# EAGLE board qad-center-v0.8.7 (EAGLE 6.4.4)
REVISION: R1.0; VERSION: V0.8.7
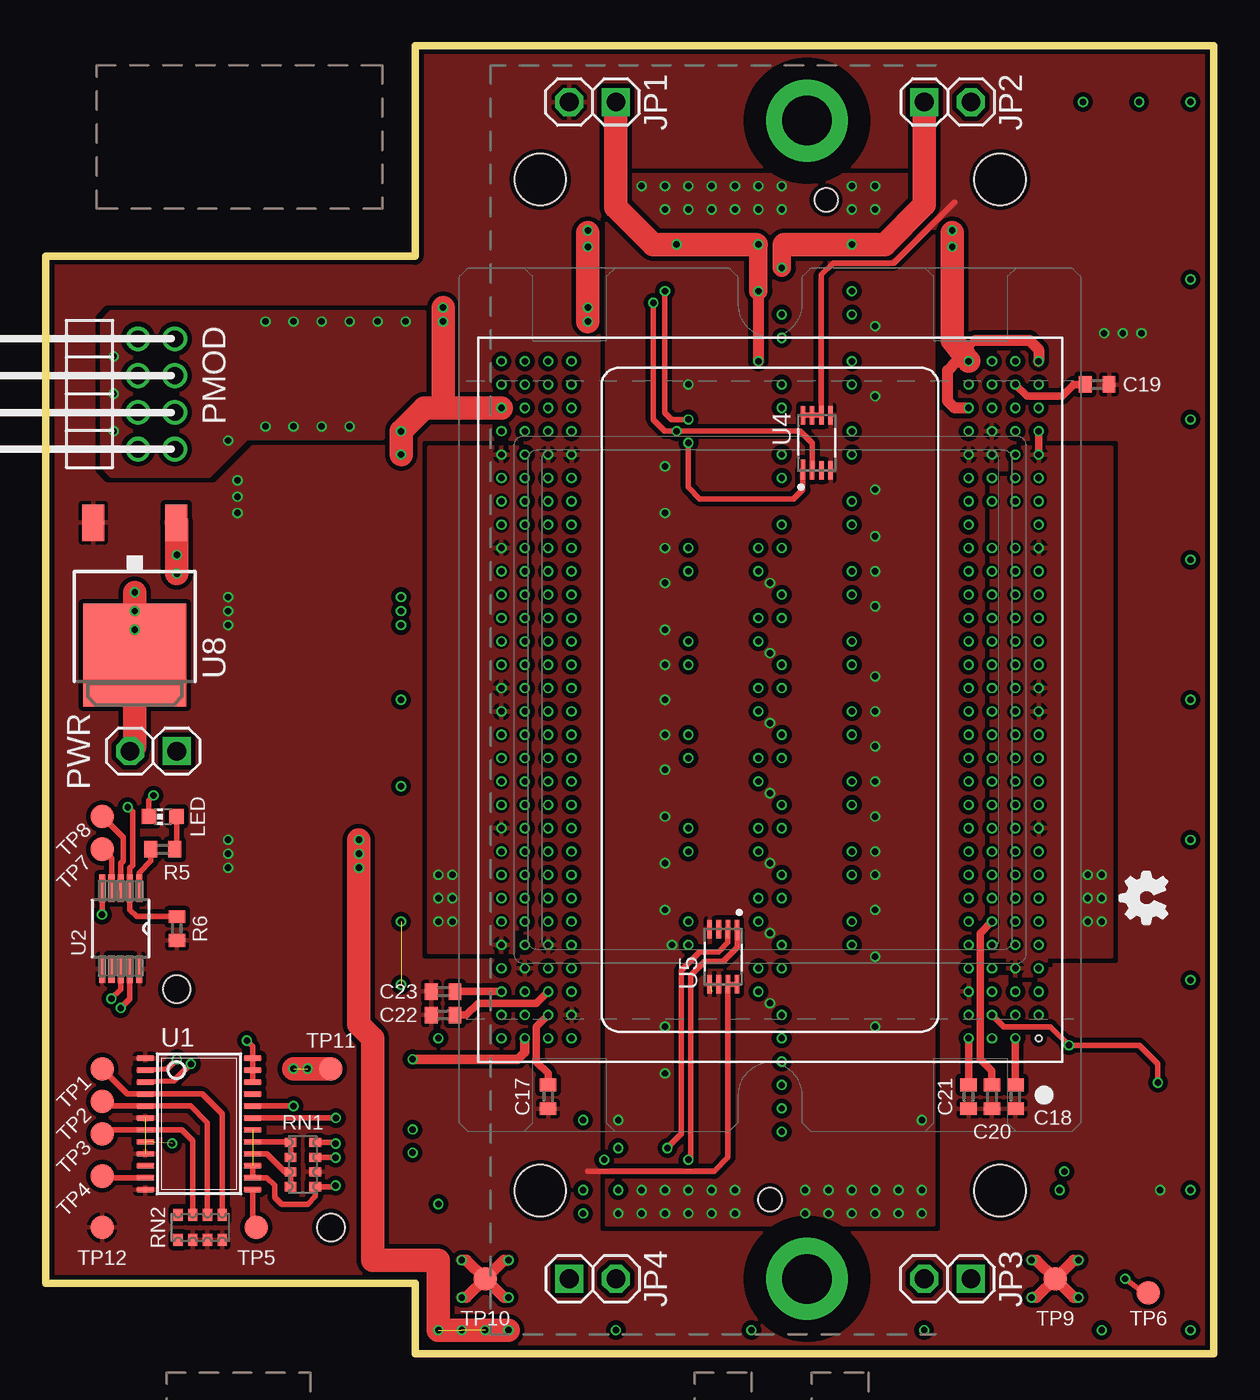
[diagram p3: board, top side]
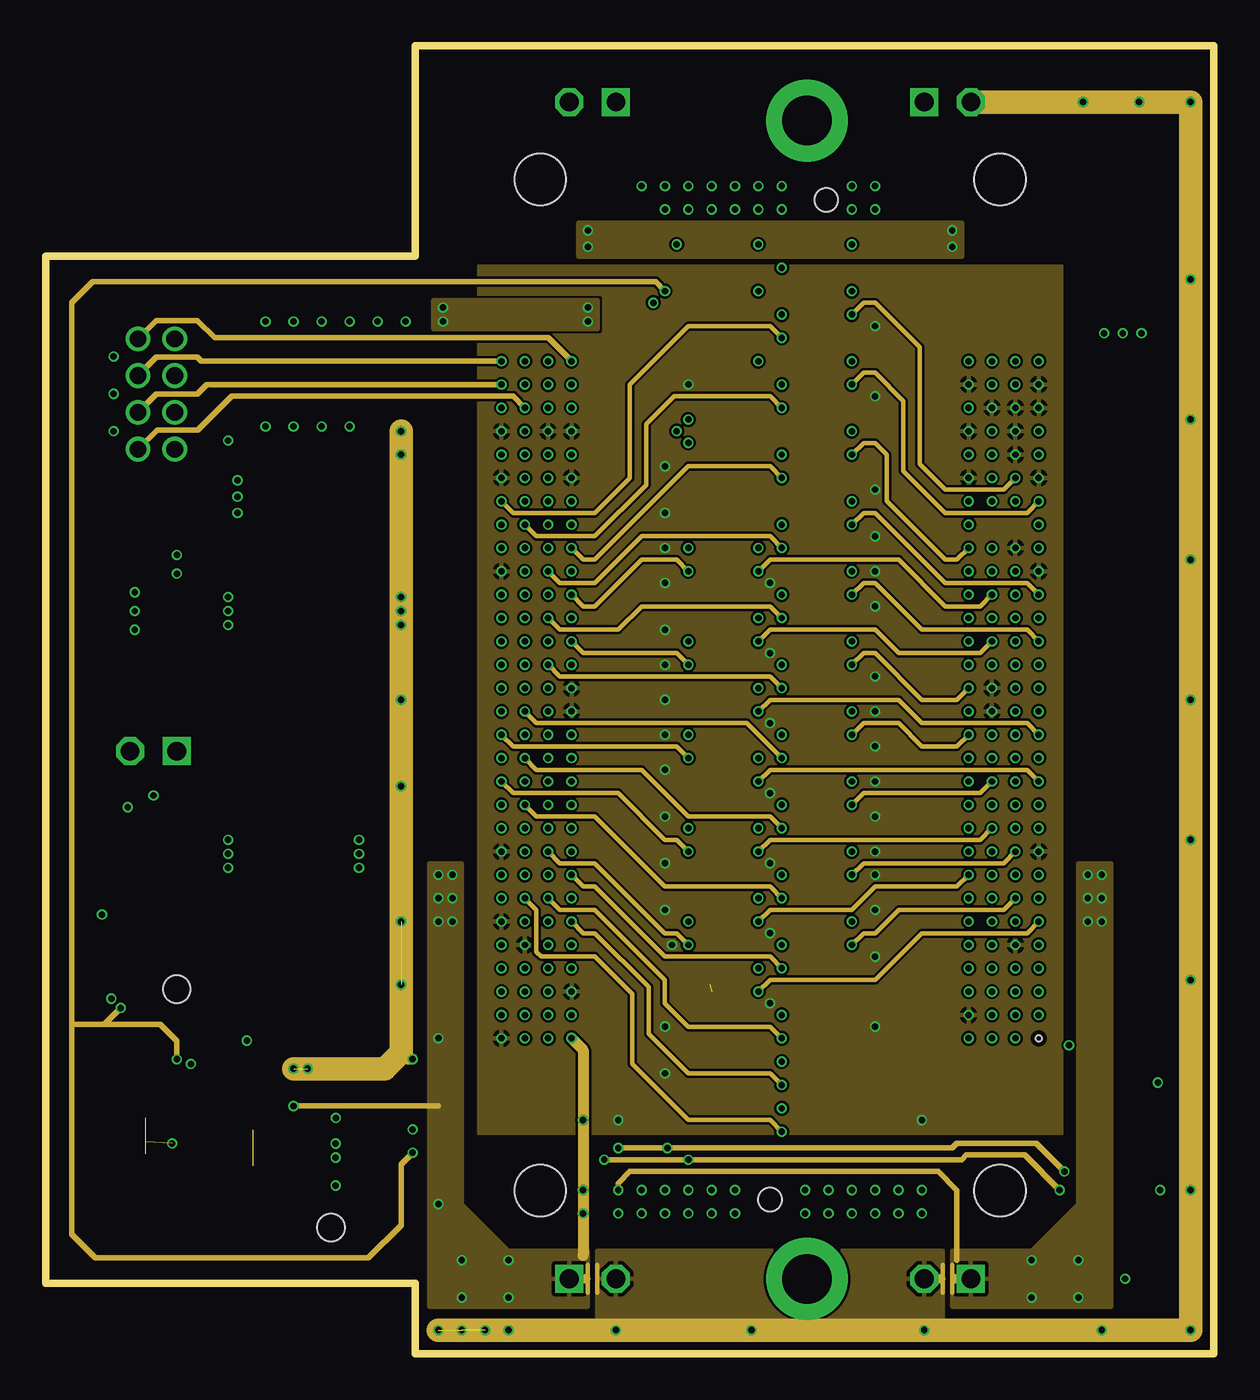
[diagram p4: board, inner layer TopSignal]
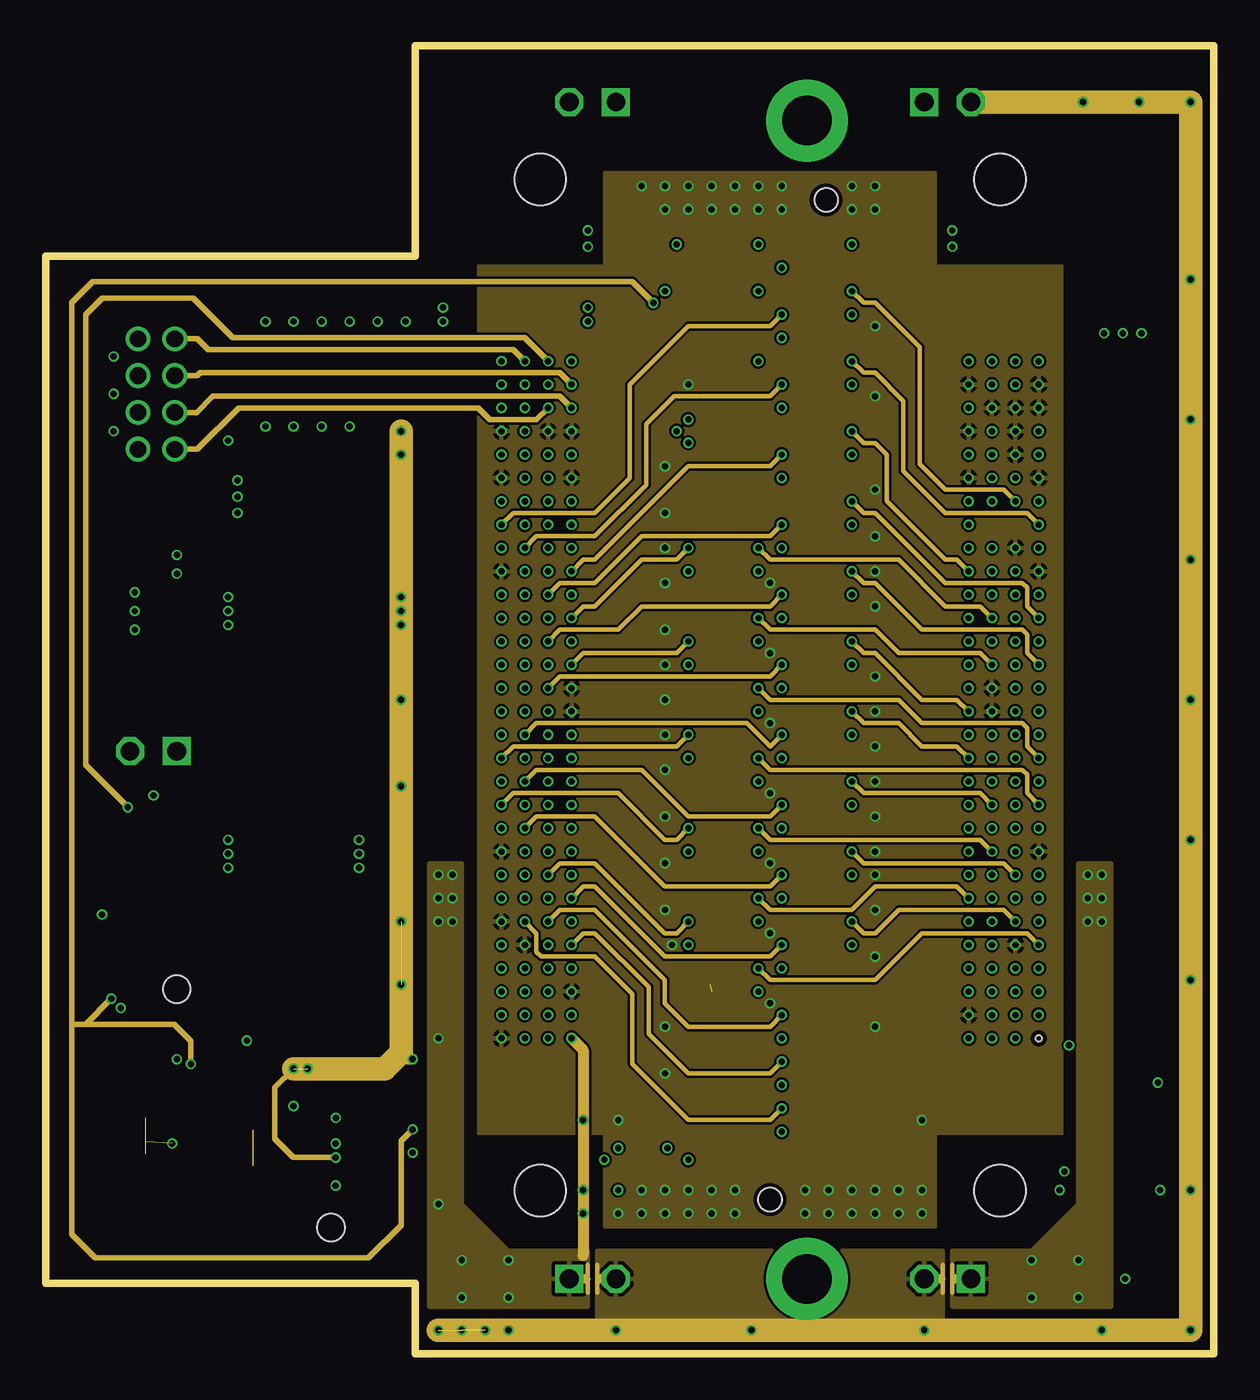
[diagram p5: board, inner layer BottomSignal]
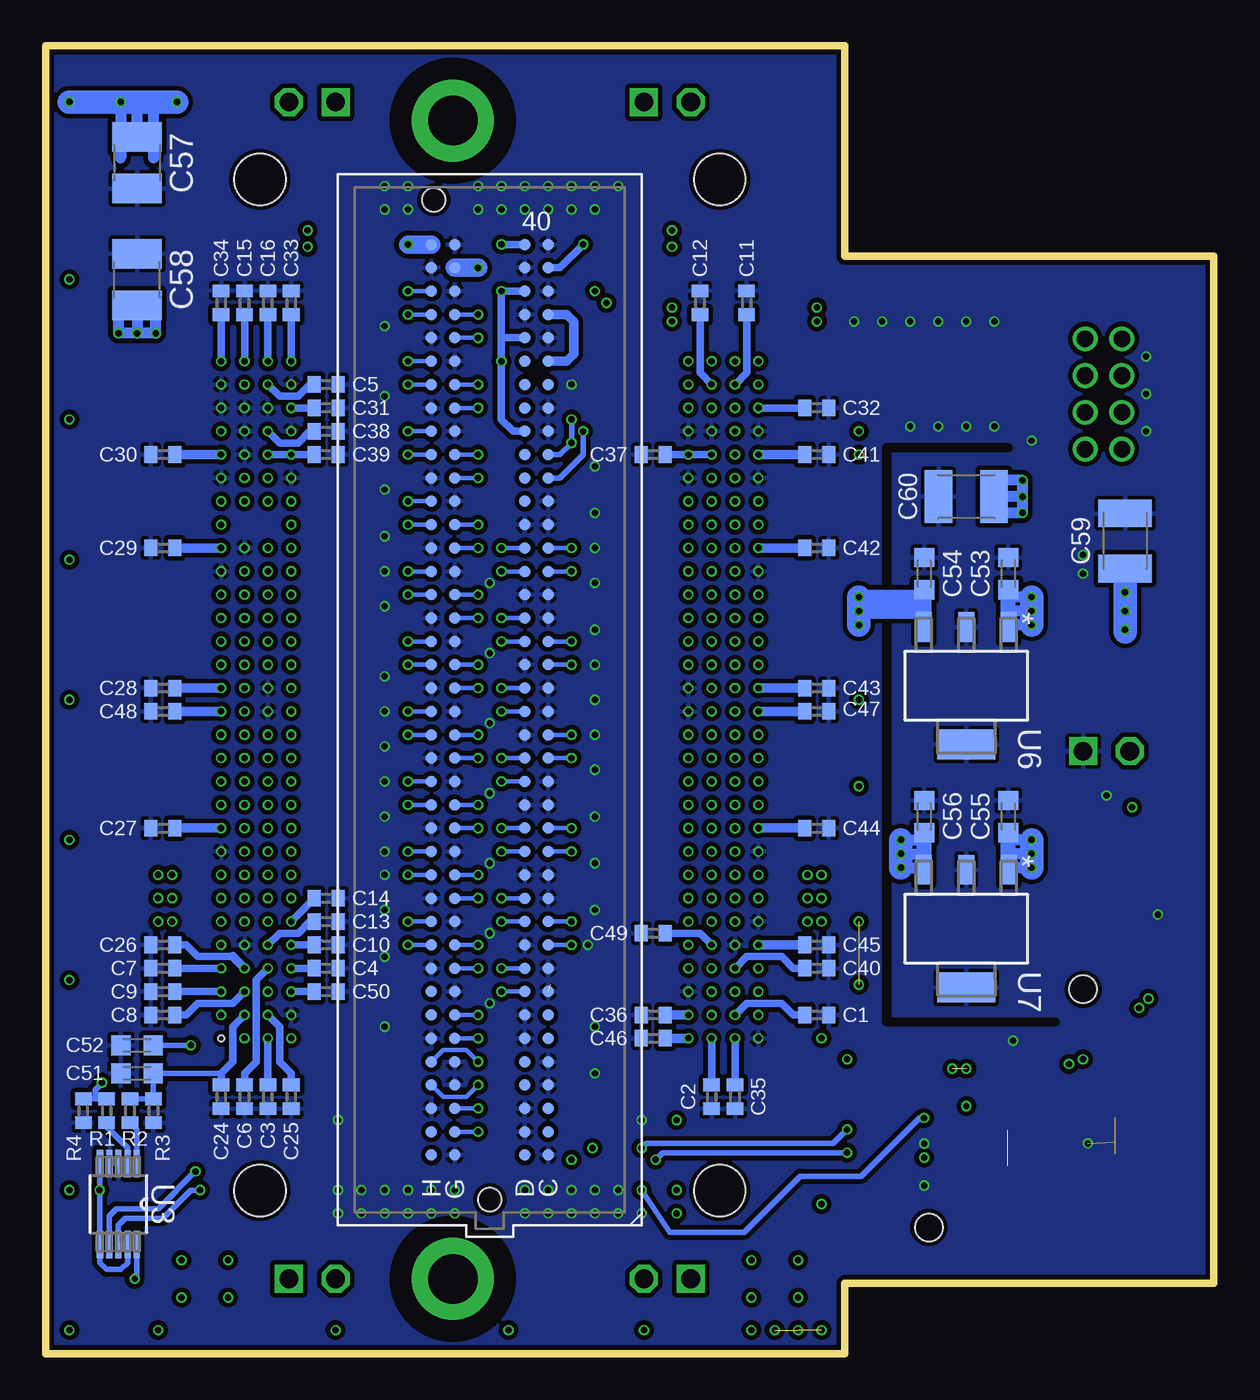
[diagram p6: board, bottom side, seen from below]

Size 63.5 x 71.12 mm. Coordinates in mm from the lower left corner, seen from the top.
Outline: 20.07,0 63.5,0 63.5,71.12 20.07,71.12 20.07,59.68 0,59.68 0,3.81 20.07,3.81 20.07,0
Copper layers (1+2*15+16): Top 0.035559375mm / dielectric 0.17018125mm / TopSignal 0.01778125mm / dielectric 47mil / BottomSignal 0.01778125mm / dielectric 0.2007mm / Bottom 0.035559375mm
Design rules "LaenPCBOrder4L *": minimum track width 5mil, minimum drill 10mil, track to track 5mil, track to pad 5mil, pad to pad 5mil, via to via 5mil, smd to smd 5mil, copper to edge 10mil, drill to drill 5mil, minimum pad ring 4mil, minimum via ring 4mil, stop-mask expansion 4mil, vias tented up to drill 20mil, thermal gap 8mil
Holes 1.5 mm at 15.49,6.86 7.11,19.81
bRestrict: 3 lines

## Footprints (pad centres in the part's own frame; a part is rotated, then mirrored left to right if it is on the bottom)
C0402 = smd 0.7 x 0.9: 1 -0.65,0; 2 0.65,0
C0603K = smd 1.05 x 1.08: 1 -0.875,0; 2 0.875,0
C1210 = smd 1.6 x 2.7: 1 -1.4,0; 2 1.4,0
C1210K = smd 1.5 x 2.9: 1 -1.5,0; 2 1.5,0
1X02-S = drill 1.016 square: 1 -1.27,0 | drill 1.016 octagon: 2 1.27,0
CHIP-LED0603 = smd 0.8 x 0.8: A 0,-0.75; C 0,0.75
2X04/90/2MM = drill 0.9: 1 -3,-4; 2 -1,-4; 3 1,-4; 4 3,-4; 7 -3,-2; 8 -1,-2; 9 1,-2; 10 3,-2
R0402 = smd 0.7 x 0.9: 1 -0.65,0; 2 0.65,0
CAT16 = smd 0.5 x 0.65: 1 -1.2,-0.675; 2 -0.4,-0.675; 3 0.4,-0.675; 4 1.2,-0.675; 5 1.2,0.675; 6 0.4,0.675; 7 -0.4,0.675; 8 -1.2,0.675
B1,27 = smd 1.27 x 1.27: TP 0,0
TSSOP24 = smd 0.305 x 0.991: 1 -3.575,-2.918; 2 -2.925,-2.918; 3 -2.275,-2.918; 4 -1.625,-2.918; 5 -0.975,-2.918; 6 -0.325,-2.918; 7 0.325,-2.918; 8 0.975,-2.918; 9 1.625,-2.918; 10 2.275,-2.918; 11 2.925,-2.918; 12 3.575,-2.918; 13 3.575,2.918; 14 2.925,2.918; 15 2.275,2.918; 16 1.625,2.918; 17 0.975,2.918; 18 0.325,2.918; 19 -0.325,2.918; 20 -0.975,2.918; 21 -1.625,2.918; 22 -2.275,2.918; 23 -2.925,2.918; 24 -3.575,2.918
TSSOP-10 = smd 1.499 x 0.33: 1 -2.2,1; 2 -2.2,0.5; 3 -2.2,0; 4 -2.2,-0.5; 5 -2.2,-1; 6 2.2,-1; 7 2.2,-0.5; 8 2.2,0; 9 2.2,0.5; 10 2.2,1
SOP50P490X110-10N = smd 1.499 x 0.33: 1 -2.2,1; 2 -2.2,0.5; 3 -2.2,0; 4 -2.2,-0.5; 5 -2.2,-1; 6 2.2,-1; 7 2.2,-0.5; 8 2.2,0; 9 2.2,0.5; 10 2.2,1
SOT996-2/3 = smd 0.25 x 1.1: 1 -0.75,-1.45 | smd 0.25 x 1: 2 -0.25,-1.5; 3 0.25,-1.5; 4 0.75,-1.5; 5 0.75,1.5; 6 0.25,1.5; 7 -0.25,1.5; 8 -0.75,1.5
SOT230P700X180-4N = smd 1.626 x 0.889: 1 -3.2,2.311; 2 -3.2,0; 3 -3.2,-2.311 | smd 1.626 x 3.175: 4 3.2,0
TO252 = smd 1.2 x 2: 1 -2.25,-4.8; 2 2.25,-4.8 | smd 5.6 x 5.6: 3 0,2.4
10-30-07-237-400T4+LM = drill 0.35: A2 -17.145,-14.605; A3 -15.875,-14.605; A4 -14.605,-14.605; A5 -13.335,-14.605; A6 -12.065,-14.605; A7 -10.795,-14.605; A8 -9.525,-14.605; A9 -8.255,-14.605; A10 -6.985,-14.605; A11 -5.715,-14.605; A12 -4.445,-14.605; A13 -3.175,-14.605; A14 -1.905,-14.605; A15 -0.635,-14.605; A16 0.635,-14.605; A17 1.905,-14.605; A18 3.175,-14.605; A19 4.445,-14.605; A20 5.715,-14.605; A21 6.985,-14.605; A22 8.255,-14.605; A23 9.525,-14.605; A24 10.795,-14.605; A25 12.065,-14.605; A26 13.335,-14.605; A27 14.605,-14.605; A28 15.875,-14.605; A29 17.145,-14.605; A30 18.415,-14.605; B1 -18.415,-13.335; B2 -17.145,-13.335; B3 -15.875,-13.335; B4 -14.605,-13.335; B5 -13.335,-13.335; B6 -12.065,-13.335; B7 -10.795,-13.335; B8 -9.525,-13.335; B9 -8.255,-13.335; B10 -6.985,-13.335; B11 -5.715,-13.335; B12 -4.445,-13.335; B13 -3.175,-13.335; B14 -1.905,-13.335; B15 -0.635,-13.335; B16 0.635,-13.335; B17 1.905,-13.335; B18 3.175,-13.335; B19 4.445,-13.335; B20 5.715,-13.335; B21 6.985,-13.335; B22 8.255,-13.335; B24 10.795,-13.335; B25 12.065,-13.335; B26 13.335,-13.335; B27 14.605,-13.335; B28 15.875,-13.335; B29 17.145,-13.335; B30 18.415,-13.335; C1 -18.415,-12.065; C2 -17.145,-12.065; C3 -15.875,-12.065; C4 -14.605,-12.065; C5 -13.335,-12.065; C6 -12.065,-12.065; C7 -10.795,-12.065; C8 -9.525,-12.065; C9 -8.255,-12.065; C10 -6.985,-12.065; C11 -5.715,-12.065; C12 -4.445,-12.065; C13 -3.175,-12.065; C14 -1.905,-12.065; C15 -0.635,-12.065; C16 0.635,-12.065; C17 1.905,-12.065; C18 3.175,-12.065; C19 4.445,-12.065; C20 5.715,-12.065; C21 6.985,-12.065; C22 8.255,-12.065; C24 10.795,-12.065; C25 12.065,-12.065; C26 13.335,-12.065; C27 14.605,-12.065; C28 15.875,-12.065; C29 17.145,-12.065; C30 18.415,-12.065; D1 -18.415,-10.795; D2 -17.145,-10.795; D3 -15.875,-10.795; D4 -14.605,-10.795; D5 -13.335,-10.795; D6 -12.065,-10.795; D7 -10.795,-10.795; D8 -9.525,-10.795; D9 -8.255,-10.795; D10 -6.985,-10.795; D11 -5.715,-10.795; D12 -4.445,-10.795; D13 -3.175,-10.795; D14 -1.905,-10.795; D15 -0.635,-10.795; D16 0.635,-10.795; D17 1.905,-10.795; D18 3.175,-10.795; D19 4.445,-10.795; D20 5.715,-10.795; D21 6.985,-10.795; D22 8.255,-10.795; D23 9.525,-10.795; D24 10.795,-10.795; D25 12.065,-10.795; D26 13.335,-10.795; D27 14.605,-10.795; D28 15.875,-10.795; D29 17.145,-10.795; D30 18.415,-10.795; E1 -18.415,10.795; E2 -17.145,10.795; E3 -15.875,10.795; E4 -14.605,10.795; E5 -13.335,10.795; E6 -12.065,10.795; E7 -10.795,10.795; E8 -9.525,10.795; E9 -8.255,10.795; E10 -6.985,10.795; E11 -5.715,10.795; E12 -4.445,10.795; E13 -3.175,10.795; E14 -1.905,10.795; E15 -0.635,10.795; E16 0.635,10.795; E17 1.905,10.795; E18 3.175,10.795; E19 4.445,10.795; E20 5.715,10.795; E21 6.985,10.795; E22 8.255,10.795; E23 9.525,10.795; E24 10.795,10.795; E25 12.065,10.795; E26 13.335,10.795; E27 14.605,10.795; E28 15.875,10.795; E29 17.145,10.795; E30 18.415,10.795; F1 -18.415,12.065; F2 -17.145,12.065; F3 -15.875,12.065; F4 -14.605,12.065; F5 -13.335,12.065; F6 -12.065,12.065; F7 -10.795,12.065; F8 -9.525,12.065; F9 -8.255,12.065; F10 -6.985,12.065; F11 -5.715,12.065; F12 -4.445,12.065; F13 -3.175,12.065; F14 -1.905,12.065; F15 -0.635,12.065; F16 0.635,12.065; F17 1.905,12.065; F18 3.175,12.065; F19 4.445,12.065; F20 5.715,12.065; F21 6.985,12.065; F22 8.255,12.065; F23 9.525,12.065; F24 10.795,12.065; F25 12.065,12.065; F26 13.335,12.065; F27 14.605,12.065; F28 15.875,12.065; F29 17.145,12.065; F30 18.415,12.065; G1 -18.415,13.335; G2 -17.145,13.335; G3 -15.875,13.335; G4 -14.605,13.335; G5 -13.335,13.335; G6 -12.065,13.335; G7 -10.795,13.335; G8 -9.525,13.335; G9 -8.255,13.335; G10 -6.985,13.335; G11 -5.715,13.335; G12 -4.445,13.335; G13 -3.175,13.335; G14 -1.905,13.335; G15 -0.635,13.335; G16 0.635,13.335; G17 1.905,13.335; G18 3.175,13.335; G19 4.445,13.335; G20 5.715,13.335; G21 6.985,13.335; G22 8.255,13.335; G23 9.525,13.335; G24 10.795,13.335; G25 12.065,13.335; G26 13.335,13.335; G27 14.605,13.335; G28 15.875,13.335; G29 17.145,13.335; G30 18.415,13.335; H1 -18.415,14.605; H2 -17.145,14.605; H3 -15.875,14.605; H4 -14.605,14.605; H5 -13.335,14.605; H6 -12.065,14.605; H7 -10.795,14.605; H8 -9.525,14.605; H9 -8.255,14.605; H10 -6.985,14.605; H11 -5.715,14.605; H12 -4.445,14.605; H13 -3.175,14.605; H14 -1.905,14.605; H15 -0.635,14.605; H16 0.635,14.605; H17 1.905,14.605; H18 3.175,14.605; H19 4.445,14.605; H20 5.715,14.605; H21 6.985,14.605; H22 8.255,14.605; H23 9.525,14.605; H24 10.795,14.605; H25 12.065,14.605; H26 13.335,14.605; H27 14.605,14.605; H28 15.875,14.605; H29 17.145,14.605; H30 18.415,14.605 | hole 0.35: -18.415,-14.605 | hole 2.8: 28.3,12.5; 28.3,-12.5; -26.7,-12.5; -26.7,12.5
ASP-134604-01-ZED = smd 0.635 x 0.635 bottom: C1 24.765,-3.175; C2 23.495,-3.175; C3 22.225,-3.175; C4 20.955,-3.175; C5 19.685,-3.175; C6 18.415,-3.175; C7 17.145,-3.175; C8 15.875,-3.175; C9 14.605,-3.175; C10 13.335,-3.175; C11 12.065,-3.175; C12 10.795,-3.175; C13 9.525,-3.175; C14 8.255,-3.175; C15 6.985,-3.175; C16 5.715,-3.175; C17 4.445,-3.175; C18 3.175,-3.175; C19 1.905,-3.175; C20 0.635,-3.175; C21 -0.635,-3.175; C22 -1.905,-3.175; C23 -3.175,-3.175; C24 -4.445,-3.175; C25 -5.715,-3.175; C26 -6.985,-3.175; C27 -8.255,-3.175; C28 -9.525,-3.175; C29 -10.795,-3.175; C30 -12.065,-3.175; C31 -13.335,-3.175; C32 -14.605,-3.175; C33 -15.875,-3.175; C34 -17.145,-3.175; C35 -18.415,-3.175; C36 -19.685,-3.175; C37 -20.955,-3.175; C38 -22.225,-3.175; C39 -23.495,-3.175; C40 -24.765,-3.175; D1 24.765,-1.905; D2 23.495,-1.905; D3 22.225,-1.905; D4 20.955,-1.905; D5 19.685,-1.905; D6 18.415,-1.905; D7 17.145,-1.905; D8 15.875,-1.905; D9 14.605,-1.905; D10 13.335,-1.905; D11 12.065,-1.905; D12 10.795,-1.905; D13 9.525,-1.905; D14 8.255,-1.905; D15 6.985,-1.905; D16 5.715,-1.905; D17 4.445,-1.905; D18 3.175,-1.905; D19 1.905,-1.905; D20 0.635,-1.905; D21 -0.635,-1.905; D22 -1.905,-1.905; D23 -3.175,-1.905; D24 -4.445,-1.905; D25 -5.715,-1.905; D26 -6.985,-1.905; D27 -8.255,-1.905; D28 -9.525,-1.905; D29 -10.795,-1.905; D30 -12.065,-1.905; D31 -13.335,-1.905; D32 -14.605,-1.905; D33 -15.875,-1.905; D34 -17.145,-1.905; D35 -18.415,-1.905; D36 -19.685,-1.905; D37 -20.955,-1.905; D38 -22.225,-1.905; D39 -23.495,-1.905; D40 -24.765,-1.905; G1 24.765,1.905; G2 23.495,1.905; G3 22.225,1.905; G4 20.955,1.905; G5 19.685,1.905; G6 18.415,1.905; G7 17.145,1.905; G8 15.875,1.905; G9 14.605,1.905; G10 13.335,1.905; G11 12.065,1.905; G12 10.795,1.905; G13 9.525,1.905; G14 8.255,1.905; G15 6.985,1.905; G16 5.715,1.905; G17 4.445,1.905; G18 3.175,1.905; G19 1.905,1.905; G20 0.635,1.905; G21 -0.635,1.905; G22 -1.905,1.905; G23 -3.175,1.905; G24 -4.445,1.905; G25 -5.715,1.905; G26 -6.985,1.905; G27 -8.255,1.905; G28 -9.525,1.905; G29 -10.795,1.905; G30 -12.065,1.905; G31 -13.335,1.905; G32 -14.605,1.905; G33 -15.875,1.905; G34 -17.145,1.905; G35 -18.415,1.905; G36 -19.685,1.905; G37 -20.955,1.905; G38 -22.225,1.905; G39 -23.495,1.905; G40 -24.765,1.905; H1 24.765,3.175; H2 23.495,3.175; H3 22.225,3.175; H4 20.955,3.175; H5 19.685,3.175; H6 18.415,3.175; H7 17.145,3.175; H8 15.875,3.175; H9 14.605,3.175; H10 13.335,3.175; H11 12.065,3.175; H12 10.795,3.175; H13 9.525,3.175; H14 8.255,3.175; H15 6.985,3.175; H16 5.715,3.175; H17 4.445,3.175; H18 3.175,3.175; H19 1.905,3.175; H20 0.635,3.175; H21 -0.635,3.175; H22 -1.905,3.175; H23 -3.175,3.175; H24 -4.445,3.175; H25 -5.715,3.175; H26 -6.985,3.175; H27 -8.255,3.175; H28 -9.525,3.175; H29 -10.795,3.175; H30 -12.065,3.175; H31 -13.335,3.175; H32 -14.605,3.175; H33 -15.875,3.175; H34 -17.145,3.175; H35 -18.415,3.175; H36 -19.685,3.175; H37 -20.955,3.175; H38 -22.225,3.175; H39 -23.495,3.175; H40 -24.765,3.175 | drill 2.692 pad 4.445: M1 -31.496,2.007; M2 31.496,2.007 | hole 1.27: 27.191,0; -27.191,3.048

## Placement (x,y rotation side)
C1  100n  [C0402]  21.59,18.42 0 bottom
C2  100n  [C0402]  27.3,13.97 270 bottom
C3  100n  [C0402]  51.43,13.97 270 bottom
C4  100n  [C0402]  48.26,20.96 0 bottom
C5  100n  [C0402]  48.26,52.7 0 bottom
C6  100n  [C0402]  52.7,13.97 270 bottom
C7  100n  [C0402]  57.15,20.96 180 bottom
C8  100n  [C0402]  57.15,18.42 180 bottom
C9  100n  [C0402]  57.15,19.69 180 bottom
C10  100n  [C0402]  48.26,22.23 0 bottom
C11  100n  [C0402]  25.4,57.15 90 bottom
C12  100n  [C0402]  27.94,57.15 90 bottom
C13  100n  [C0402]  48.26,23.5 0 bottom
C14  100n  [C0402]  48.26,24.77 0 bottom
C15  100n  [C0402]  52.7,57.15 90 bottom
C16  100n  [C0402]  51.43,57.15 90 bottom
C17  100n  [C0402]  27.3,13.97 90 top
C18  100n  [C0402]  52.7,13.97 90 top
C19  100n  [C0402]  57.15,52.7 180 top
C20  100n  [C0402]  51.43,13.97 90 top
C21  100n  [C0402]  50.16,13.97 90 top
C22  100n  [C0402]  21.59,18.42 0 top
C23  100n  [C0402]  21.59,19.69 0 top
C24  100n  [C0402]  53.97,13.97 270 bottom
C25  100n  [C0402]  50.16,13.97 270 bottom
C26  100n  [C0402]  57.15,22.23 180 bottom
C27  100n  [C0402]  57.15,28.58 180 bottom
C28  100n  [C0402]  57.15,36.2 180 bottom
C29  100n  [C0402]  57.15,43.82 180 bottom
C30  100n  [C0402]  57.15,48.9 180 bottom
C31  100n  [C0402]  48.26,51.44 0 bottom
C32  100n  [C0402]  21.59,51.44 0 bottom
C33  100n  [C0402]  50.16,57.15 90 bottom
C34  100n  [C0402]  53.97,57.15 90 bottom
C35  100n  [C0402]  26.03,13.97 270 bottom
C36  100n  [C0402]  30.48,18.42 180 bottom
C37  100n  [C0402]  30.48,48.9 180 bottom
C38  100n  [C0402]  48.26,50.17 0 bottom
C39  100n  [C0402]  48.26,48.9 0 bottom
C40  100n  [C0402]  21.59,20.96 0 bottom
C41  100n  [C0402]  21.59,48.9 0 bottom
C42  100n  [C0402]  21.59,43.82 0 bottom
C43  100n  [C0402]  21.59,36.2 0 bottom
C44  100n  [C0402]  21.59,28.58 0 bottom
C45  100n  [C0402]  21.59,22.23 0 bottom
C46  100n  [C0402]  30.48,17.15 180 bottom
C47  100n  [C0402]  21.59,34.93 0 bottom
C48  100n  [C0402]  57.15,34.93 180 bottom
C49  100n  [C0402]  30.48,22.86 180 bottom
C50  100n  [C0402]  48.26,19.69 0 bottom
C51  10u  [C0603K]  58.55,15.24 180 bottom
C52  10u  [C0603K]  58.55,16.76 180 bottom
C53  10u  [C0603K]  11.18,42.42 90 bottom
C54  10u  [C0603K]  15.75,42.42 90 bottom
C55  10u  [C0603K]  11.18,29.21 90 bottom
C56  10u  [C0603K]  15.75,29.21 90 bottom
C57  100u  [C1210]  58.55,64.77 270 bottom
C58  100u  [C1210]  58.55,58.42 90 bottom
C59  100u  [C1210K]  4.83,44.2 90 bottom
C60  100u  [C1210K]  13.46,46.61 180 bottom
JP1  [1X02-S]  29.72,68.07 180 top
JP2  [1X02-S]  49.02,68.07 0 top
JP3  [1X02-S]  49.02,4.06 180 top
JP4  [1X02-S]  29.72,4.06 0 top
LED  RED  [CHIP-LED0603]  6.35,29.21 90 top
PMOD  PMOD-8  [2X04/90/2MM]  3,52.19 90 top
PWR  [1X02-S]  5.84,32.77 180 top
R1  1R  [R0402]  60.2,13.21 270 bottom
R2  1R  [R0402]  58.93,13.21 270 bottom
R3  [R0402]  57.66,13.21 270 bottom
R4  [R0402]  61.47,13.21 270 bottom
R5  220R  [R0402]  6.35,27.43 0 top
R6  10k  [R0402]  7.11,23.11 90 top
RN1  10k  [CAT16]  13.97,10.28 90 top
RN2  10k  [CAT16]  8.38,6.86 0 top
TP1  TPB1,27  [B1,27]  3.05,15.49 0 top
TP2  TPB1,27  [B1,27]  3.05,13.72 0 top
TP3  TPB1,27  [B1,27]  3.05,11.94 0 top
TP4  TPB1,27  [B1,27]  3.05,9.65 0 top
TP5  TPB1,27  [B1,27]  11.43,6.86 0 top
TP6  TPB1,27  [B1,27]  59.94,3.3 0 top
TP7  TPB1,27  [B1,27]  3.05,27.43 0 top
TP8  TPB1,27  [B1,27]  3.05,29.21 0 top
TP9  TPB1,27  [B1,27]  54.86,4.06 0 top
TP10  TPB1,27  [B1,27]  23.88,4.06 0 top
TP11  TPB1,27  [B1,27]  15.49,15.49 0 top
TP12  TPB1,27  [B1,27]  3.05,6.86 0 top
U1  LM96080  [TSSOP24]  8.32,12.49 270 top
U2  PCA9537  [TSSOP-10]  4.06,23.11 270 top
U3  AD5647R  [SOP50P490X110-10N]  59.56,8.13 270 bottom
U4  LM75BGD  [SOT996-2/3]  41.91,49.53 0 top
U5  LM75BGD  [SOT996-2/3]  36.83,21.59 180 top
U6  MCP1826S-3002E/DB  [SOT230P700X180-4N]  13.46,36.32 270 bottom
U7  MCP1826S-1802E/DB  [SOT230P700X180-4N]  13.46,23.11 270 bottom
U8  AP1084TO252  [TO252]  4.83,40.39 180 top
U$1  CMV12000ANDON+LM  [10-30-07-237-400T4+LM]  39.37,35.56 90 top
U$5  [OSHW_FILLX100_NOTEXT]  60.96,23.37 90 top
ZED1  FMC-LPC-ZED_NOCCZED  [ASP-134604-01-ZED]  39.37,35.56 270 top

## Tracks (layer width: path | path; a pad name or v marks a point on that pad's centre or on a via)
+1V8  (via drill 0.35, 0.35 pad 0.41)  (2 unrouted)
  Top 1.27: v25.15,1.27 v21.34,1.27 21.34,5.08 17.78,5.08 17.78,17.15 17.02,17.91 v17.02,26.42 v17.02,27.18 v17.02,27.94
  TopSignal 0.254: 29.97,3.3 29.97,4.83 | 48.77,3.3 48.77,4.83
  TopSignal 0.508: JP3.2 48.64,4.06
  TopSignal 1.27: v21.34,1.27 v30.99,1.27 v38.35,1.27 v47.75,1.27 v57.4,1.27 v62.23,1.27 v62.23,8.89 v62.23,20.32 v62.23,27.94 v62.23,35.56 v62.23,43.18 v62.23,50.8 v62.23,58.42 v62.23,68.07 v56.39,68.07 JP2.2
  BottomSignal 0.254: 29.97,3.3 29.97,4.83 | 48.77,3.3 48.77,4.83
  BottomSignal 0.508: 30.1,4.06 JP4.2 | JP3.2 48.64,4.06
  BottomSignal 1.27: JP2.2 v56.39,68.07 v62.23,68.07 v62.23,58.42 v62.23,50.8 v62.23,43.18 v62.23,35.56 v62.23,27.94 v62.23,20.32 v62.23,8.89 v62.23,1.27 v57.4,1.27 v47.75,1.27 v38.35,1.27 v30.99,1.27 v21.34,1.27
  Bottom 0.61: 15.77,26.42 U7.3 | v17.02,27.18 15.75,27.18 | v17.02,26.42 15.75,26.42 | v17.02,27.94 15.75,27.94 | C57.1 58.55,68.07 | 57.66,68.07 57.66,65.02 | v59.44,68.07 59.44,65.02
  Bottom 0.813: U7.3 15.75,26.31 15.75,26.42 15.75,27.18 15.75,27.94 C56.1
  Bottom 1.27: v17.02,27.94 v17.02,27.18 v17.02,26.42 | v56.39,68.07 57.66,68.07 58.55,68.07 v59.44,68.07 v62.23,68.07
  other vias: 22.61,1.27 23.88,1.27
  pour BottomSignal: 29.97,5.59 48.77,5.59 48.77,1.02 29.97,1.02
  pour TopSignal: 29.97,5.59 48.77,5.59 48.77,1.02 29.97,1.02
+1V8A  (via drill 0.35, 0.35 pad 0.41)
  Top 0.305: U1.19 v15.76,12.82
  Top 0.406: U$1.A26 U$1.A27
  Top 0.61: TP9.TP 55.88,3.05 v56.13,3.05 | TP9.TP 53.85,3.05 v53.59,3.05 | TP9.TP 55.88,5.08 v56.13,5.08 | TP9.TP 53.85,5.08 v53.59,5.08
  TopSignal 0.254: 49.28,3.3 49.28,4.83
  TopSignal 0.305: 49.53,5.08 49.53,8.89 48.51,9.91 31.75,9.91 31.11,9.27 v31.11,8.89
  TopSignal 0.508: 49.4,4.06 JP3.1
  BottomSignal 0.254: 49.28,3.3 49.28,4.83
  BottomSignal 0.508: 49.4,4.06 JP3.1
  Bottom 0.305: v31.11,8.89 29.59,6.6 25.53,6.6 22.48,9.65 19.18,9.65 16,12.83 15.77,12.83 v15.76,12.82
  Bottom 0.406: C26.1 55.88,22.23 55.24,21.59 53.34,21.59
  Bottom 0.508: C27.1 U$1.A10 | 53.34,21.59 U$1.B4 | C28.1 U$1.A16 | C29.1 U$1.A22 | C30.1 U$1.A26 | U$1.A15 C48.1
  other vias: 56.64,26.04 57.4,26.04 56.64,24.77 57.4,24.77 56.64,23.5 57.4,23.5
  pour BottomSignal: 49.28,5.59 53.59,5.59 56.13,8.13 56.13,26.67 57.91,26.67 57.91,2.54 49.28,2.54
  pour Top (isolate 0.152, rank 3): 57.91,49.28 52.7,49.28 52.7,47.62 51.43,47.62 51.43,21.59 52.32,21.59 52.32,20.57 54.36,20.57 54.36,21.59 57.91,21.59
  pour TopSignal: 49.28,5.59 53.59,5.59 56.13,8.13 56.13,26.67 57.91,26.67 57.91,2.54 49.28,2.54
+1V8B  (via drill 0.35)
  Top 0.305: U1.20 v13.46,13.46
  Top 0.61: TP10.TP 24.89,5.08 v25.15,5.08 | TP10.TP 22.86,5.08 v22.61,5.08 | TP10.TP 22.86,3.05 v22.61,3.05 | TP10.TP 24.89,3.05 v25.15,3.05
  TopSignal 0.254: 29.46,4.83 29.46,3.3
  TopSignal 0.305: v13.46,13.46 21.34,13.46
  TopSignal 0.508: 29.34,4.06 JP4.1
  TopSignal 0.61: U$1.E1 29.21,16.51 v29.21,12.7 v29.21,8.89 v29.21,7.62 29.21,5.33
  BottomSignal 0.254: 29.46,4.83 29.46,3.3
  BottomSignal 0.508: 29.34,4.06 JP4.1
  BottomSignal 0.61: 29.21,5.33 v29.21,7.62 v29.21,8.89 v29.21,12.7 29.21,16.51 U$1.E1
  Bottom 0.508: C42.1 U$1.H22 | C43.1 U$1.H16 | C41.1 U$1.H26 | C44.1 U$1.H10 | C45.1 U$1.H5 | U$1.H15 C47.1 | C46.1 U$1.E1
  other vias: 21.34,26.04 22.1,26.04 21.34,24.77 22.1,24.77 21.34,23.5 22.1,23.5 21.34,8.13 21.34,17.15
  pour TopSignal: 20.83,26.67 22.61,26.67 22.61,8.13 25.15,5.59 29.46,5.59 29.46,2.54 20.83,2.54
  pour Top (isolate 0.152, rank 3): 26.03,23.11 26.03,49.28 20.83,49.28 20.83,21.84 25.4,21.84 25.4,23.11
  pour BottomSignal: 20.83,26.67 22.61,26.67 22.61,8.13 25.15,5.59 29.46,5.59 29.46,2.54 20.83,2.54
+3V0  (via drill 0.35, 0.35 pad 0.41)  (2 unrouted)
  Top 0.305: RN1.3 14.66,10.66 v15.75,10.66
  Top 0.406: 50.16,54.74 50.55,55.12
  Top 0.508: U$1.G1 26.03,16.38 25.65,16 v19.94,16
  Top 0.61: U$1.D28 49.4,51.44 49.02,51.82 49.02,53.47 49.53,53.98 U$1.D30 50.16,54.74 | 50.55,55.12 53.47,55.12 53.97,54.61 U$1.A30
  Top 1.27: U$1.D30 49.28,55.12 v49.28,60.2 49.28,60.96 | v19.3,48.9 v19.3,50.17 20.57,51.44 21.59,51.44 | v29.46,56.13 v29.46,56.9 v29.46,60.2 29.46,60.96 | U$1.H28 21.59,51.44 | v21.59,56.9 v21.59,56.13 21.59,51.44 | v13.46,15.49 TP11.TP
  TopSignal 0.508: 19.3,16.26 19.3,16.38
  TopSignal 0.61: v19.94,16 19.68,16 19.3,16.38
  TopSignal 1.27: v19.3,50.17 v19.3,48.9 v19.3,39.62 v19.3,35.56 v19.3,30.86 v19.3,20.07 19.3,16.38 18.41,15.49 v13.46,15.49
  BottomSignal 0.305: v15.75,10.66 13.45,10.66 12.45,11.68 12.45,14.48 v13.46,15.49
  BottomSignal 0.61: v19.94,16 19.68,16 19.3,16.38
  BottomSignal 1.27: v19.3,50.17 v19.3,48.9 v19.3,39.62 v19.3,35.56 v19.3,30.86 v19.3,20.07 19.3,16.38 18.41,15.49 v13.46,15.49
  Bottom 0.406: C32.1 U$1.H28 | C31.1 U$1.D28 | C33.1 U$1.D30 | C34.1 U$1.A30 | U$1.G1 C35.1
  Bottom 0.813: v19.3,40.39 15.77,40.39 U6.3 15.75,39.52 15.75,41.15 | 15.75,41.15 C54.1 | 19.3,40.89 v19.3,41.15 15.75,41.15
  Bottom 1.27: v19.3,40.39 19.3,40.89 | v19.3,41.15 v19.3,40.39 | v19.3,40.39 v19.3,39.62
  other vias: 29.46,61.09 49.28,61.09 14.22,15.49 19.3,23.5
  pour TopSignal: 28.96,61.47 49.78,61.47 49.78,59.69 28.96,59.69
  pour TopSignal: 21.08,57.28 21.08,55.75 29.97,55.75 29.97,57.28
+3V3  (via drill 0.35, 0.35 pad 0.41)  (1 unrouted)
  Top 0.305: 49.42,62.61 49.42,62.63 46.1,59.31 42.79,59.31 42.16,58.67 U4.6 U4.7 U4.8 | U5.8 U5.7 37.08,10.66 36.32,9.91 29.46,9.91
  Bottom 0.305: U3.9 59.06,4.95 59.44,4.57 60.2,4.57 60.56,4.94 U3.6 60.56,8.87 v60.58,8.89 60.56,8.91 U3.5
  Bottom 0.406: U$1.G4 25.4,21.59 23.49,21.59 22.86,20.96 C40.1 | C38.1 49.15,50.17 49.78,49.53 50.8,49.53 U$1.C27 | C39.1 U$1.C26 | C37.1 U$1.F26 | C49.1 27.94,22.86 U$1.F5 | C50.1 U$1.D3
  Bottom 0.508: C36.1 U$1.E2
  Bottom 0.61: v9.91,27.94 11.18,27.94 | v9.91,26.42 11.18,26.42 | v9.91,27.18 11.18,27.18 | v9.91,39.62 11.15,39.62 U6.1 | v9.91,40.39 11.18,40.39 | v9.91,41.15 11.18,41.15 | 11.96,45.72 v10.41,45.72 v10.41,47.5 11.94,47.5 | v10.41,46.61 11.94,46.61 | C58.1 v58.55,55.5 | v57.53,55.5 57.53,57.15 59.56,57.15 v59.56,55.5 v57.53,55.5
  Bottom 0.813: U6.1 11.18,39.52 11.18,40.39 11.18,41.15 C53.1 | C55.1 11.18,27.94 11.18,27.18 11.18,26.42 11.18,26.31 U7.1 11.15,27.18 | 11.96,45.72 C60.1 | 11.94,47.5 11.94,46.61
  Bottom 1.27: v9.91,26.42 v9.91,27.18 v9.91,27.94 | v9.91,41.15 v9.91,40.39 v9.91,39.62
  pour Top (isolate 0.254, rank 4): 20.07,71.12 63.5,71.12 63.5,0 20.07,0 20.07,3.81 0,3.81 0,59.69 20.07,59.69
+5V  (via drill 0.35 pad 0.41)
  Top 1.27: v4.83,41.4 U8.3 4.83,33.02 PWR.2
  Bottom 1.27: C59.1 v4.83,41.4 v4.83,40.39 v4.83,39.37 4.83,39.26
GND  (via drill 0.35, 0.35 pad 0.41)  (3 unrouted)
  Top 0.305: v15.75,9.14 15.68,9.08 RN1.1 14.64,8.54 14.22,8.12 12.83,8.12 12.45,8.51 12.45,9.14 12.02,9.57 U1.14 U1.15 | RN1.4 15.68,11.48 v15.75,11.42 | U1.22 U1.23 U1.24 11.24,16.7 v10.92,17.02 | U2.5 3.05,25.3 v3.05,23.88 | v5.84,30.35 5.6,30.09 LED.C
  Top 1.27: U8.1 7.11,45.19 v7.11,43.43 v7.11,42.42
  other vias: 31.11,12.7 47.62,7.62 46.35,7.62 45.08,7.62 47.62,8.89 39.37,41.91 39.37,38.1 39.37,34.29 39.37,30.48 39.37,26.67 39.37,22.86 39.37,19.05 45.08,21.59 45.08,17.78 45.08,29.21 45.08,33.02 45.08,36.83 45.08,40.64 45.08,44.45 45.08,52.07 45.08,55.88 33.66,35.56 46.35,8.89 33.66,39.37 33.66,41.91 47.62,12.7 45.08,8.89 43.81,8.89 42.54,8.89 43.81,7.62 42.54,7.62 41.27,8.89 41.27,7.62 32.38,8.89 33.66,8.89 34.92,8.89 34.92,7.62 36.2,7.62 36.2,8.89 37.46,7.62 37.46,8.89 31.11,7.62 32.38,7.62 33.66,7.62 45.08,31.12 45.08,27.3 33.66,33.66 34.04,22.23 34.92,63.5 36.2,63.5 37.46,63.5 38.73,63.5 40,62.23 45.08,63.5 43.81,63.5 33.66,62.23 32.38,63.5 33.66,63.5 40,63.5 34.92,62.23 36.2,62.23 37.46,62.23 38.73,62.23 45.08,62.23 43.81,62.23 6.86,11.43 33.66,29.21 45.08,24.13 45.08,42.55 33.66,45.72 33.66,48.26 45.08,46.99 33.66,37.47 33.66,31.75 33.66,26.67 33.66,24.13 33.66,17.78 33.66,15.24 45.08,26.04 45.08,34.93 34.92,52.7 33.66,43.82 11.94,50.42 14.99,50.42 18.03,56.13 16.51,50.42 13.46,50.42 9.91,49.66 11.94,56.13 13.46,56.13 14.99,56.13 16.51,56.13 19.56,56.13 3.68,54.23 3.68,52.2 3.68,50.17
  pour Bottom (isolate 0.254): 20.07,71.12 63.5,71.12 63.5,0 20.07,0 20.07,3.81 0,3.81 0,59.69 20.07,59.69
  pour Top (isolate 0.254, rank 3): 30.48,64.14 48.26,64.14 48.26,6.99 30.48,6.99
  pour TopSignal (rank 2): 23.49,11.94 55.24,11.94 55.24,59.18 23.49,59.18
  pour BottomSignal: 48.39,6.86 48.39,11.94 55.24,11.94 55.24,59.18 48.39,59.18 48.39,64.26 30.35,64.26 30.35,59.18 23.49,59.18 23.49,11.94 30.35,11.94 30.35,6.86
  pour Top (isolate 0.254): 3.05,48.26 3.05,56.13 3.56,56.64 20.57,56.64 20.57,52.07 18.29,49.78 10.92,49.78 8.89,47.75 3.56,47.75
N$1
  Top 0.406: U$1.F2 26.67,17.78 26.67,15.88 27.3,15.24 C17.2
N$2
  Top 0.406: C18.2 U$1.B1
N$3
  Top 0.406: U$1.B29 53.34,52.07 55.24,52.07 55.88,52.7 C19.2
N$4
  Top 0.406: U$1.C6 50.8,22.86 50.8,16 51.43,15.37 C20.2
N$5
  Top 0.406: U$1.D1 C21.2
N$6
  Top 0.406: C22.2 22.86,18.42 23.49,19.05 26.67,19.05 U$1.F3
N$7
  Top 0.406: C23.2 U$1.H3
N$8
  Bottom 0.406: U$1.G2 25.4,19.05 23.49,19.05 22.86,18.42 C1.1
N$9
  Bottom 0.406: C2.1 U$1.F1
N$10
  Bottom 0.406: C3.1 U$1.C1
N$11
  Bottom 0.406: C4.1 U$1.D4
N$12
  Bottom 0.406: C5.1 49.15,52.7 49.78,52.07 50.8,52.07 U$1.C29
N$13
  Bottom 0.406: U$1.C4 52.07,20.32 52.07,15.88 52.7,15.24 C6.1
N$14
  Bottom 0.406: C7.1 U$1.A4
N$15
  Bottom 0.406: U$1.B3 53.34,19.05 55.24,19.05 55.88,18.42 C8.1
N$16
  Bottom 0.406: C9.1 U$1.A3
N$17
  Bottom 0.406: C10.1 U$1.D5
N$18
  Bottom 0.406: C11.1 25.4,53.34 U$1.G29
N$19
  Bottom 0.406: C12.1 27.94,53.34 U$1.F29
N$20
  Bottom 0.305: 49.15,23.5 C13.1
  Bottom 0.406: U$1.C5 50.8,22.86 49.78,22.86 49.15,23.5
N$21
  Bottom 0.406: C14.1 U$1.D6
N$22
  Bottom 0.406: C15.1 U$1.B30
N$23
  Bottom 0.406: C16.1 U$1.C30
N$24  (via drill 0.35)
  BottomSignal 0.254: U$1.B6 52.07,24.13 46.35,24.13 45.08,22.86 44.45,22.86 v43.81,23.5
  Bottom 0.254: v43.81,23.5 ZED1.H11
N$25  (via drill 0.35)
  TopSignal 0.254: U$1.B7 52.07,24.13 46.35,24.13 45.08,22.86 44.45,22.86 v43.81,22.23
  Bottom 0.254: v43.81,22.23 ZED1.H10
N$26
  BottomSignal 0.305: U$1.F28 26.67,50.8 24.13,50.8 23.49,51.44 10.48,51.44 8.23,49.19 PMOD.1
N$27  (via drill 0.35)
  BottomSignal 0.254: U$1.D7 49.53,25.4 45.08,25.4 43.81,24.13 39.37,24.13 v38.73,24.77
  Bottom 0.254: v38.73,24.77 ZED1.D12
N$28  (via drill 0.35)
  TopSignal 0.254: U$1.D8 49.53,25.4 45.08,25.4 43.81,24.13 39.37,24.13 v38.73,23.5
  Bottom 0.254: v38.73,23.5 ZED1.D11
N$29
  TopSignal 0.305: U$1.H29 8.75,52.7 8.24,52.19 6,52.19 PMOD.8
N$30
  BottomSignal 0.305: U$1.E28 27.94,52.07 9.08,52.07 8.2,51.19 PMOD.2
N$31
  TopSignal 0.305: U$1.G28 25.4,52.07 10.1,52.07 8.25,50.23 6.04,50.23 PMOD.7
N$32
  TopSignal 0.305: U$1.E30 27.3,55.25 9.18,55.25 8.24,56.19 6,56.19 PMOD.10
N$33
  BottomSignal 0.305: U$1.G30 25.4,54.61 8.82,54.61 8.24,55.19 PMOD.4
N$34  (via drill 0.35)
  BottomSignal 0.254: U$1.B8 52.07,26.67 44.45,26.67 v43.81,27.3
  Bottom 0.254: v43.81,27.3 ZED1.H14
N$35  (via drill 0.35)
  BottomSignal 0.254: U$1.C9 50.8,27.94 39.37,27.94 v38.73,28.58
  Bottom 0.254: v38.73,28.58 ZED1.D15
N$36  (via drill 0.35)
  TopSignal 0.254: U$1.C10 50.8,27.94 39.37,27.94 v38.73,27.3
  Bottom 0.254: v38.73,27.3 ZED1.D14
N$37
  Bottom 0.508: ZED1.C35 35.18,53.98 34.8,54.36 34.8,56.13 35.18,56.52 ZED1.C37
N$38  (via drill 0.35)
  Top 0.61: v38.73,57.79 v38.73,53.98
  Top 1.016: v38.73,57.79 v38.73,60.33 38.61,60.33
  Top 1.27: 38.61,60.33 v34.29,60.33 33.02,60.33 30.99,62.36 JP1.1
  Bottom 0.406: ZED1.D32 38.1,50.17 38.73,50.8 v38.73,53.98 | v38.73,53.98 38.73,55.25 | 38.73,55.25 v38.73,57.79 | ZED1.C39 35.56,59.06 v34.29,60.33 | ZED1.D36 38.73,55.25 | v38.73,57.79 ZED1.D38 | v38.73,60.33 ZED1.D40 | v38.73,53.98 v38.73,57.79
N$39  (via drill 0.35)
  Top 1.016: v40,59.06 40,60.33 40.13,60.33
  Top 1.27: 40.13,60.33 v43.81,60.33 45.59,60.33 47.75,62.48 JP2.1
  Bottom 1.016: ZED1.G39 v40,59.06 | v43.81,60.33 ZED1.H40
N$42
  Bottom 0.305: U3.2 59.06,11.18 60.2,12.32 R1.2
N$43  (via drill 0.35)
  BottomSignal 0.254: U$1.G10 26.67,29.21 29.84,29.21 33.66,25.4 39.37,25.4 v40,26.04
  Bottom 0.254: v40,26.04 ZED1.G13
N$44  (via drill 0.35)
  BottomSignal 0.254: v38.73,32.39 39.37,31.75 53.09,31.75 53.34,31.5 53.34,30.48 U$1.A11
  Bottom 0.254: v38.73,32.39 ZED1.D18
N$45  (via drill 0.35)
  TopSignal 0.254: U$1.A12 53.34,31.75 39.37,31.75 v38.73,31.12
  Bottom 0.254: v38.73,31.12 ZED1.D17
N$46  (via drill 0.35)
  BottomSignal 0.254: U$1.C11 50.8,30.48 44.45,30.48 v43.81,31.12
  Bottom 0.254: v43.81,31.12 ZED1.H17
N$47  (via drill 0.35)
  TopSignal 0.254: U$1.C12 50.8,30.48 44.45,30.48 v43.81,29.85
  Bottom 0.254: v43.81,29.85 ZED1.H16
N$48  (via drill 0.35)
  BottomSignal 0.254: v38.73,36.2 39.37,35.56 46.35,35.56 47.62,34.29 53.09,34.29 53.34,34.04 53.34,33.02 U$1.A13
  Bottom 0.254: v38.73,36.2 ZED1.D21
N$49  (via drill 0.35)
  TopSignal 0.254: U$1.A14 53.34,34.29 47.62,34.29 46.35,35.56 39.37,35.56 v38.73,34.93
  Bottom 0.254: v38.73,34.93 ZED1.D20
N$50  (via drill 0.35)
  BottomSignal 0.254: U$1.D13 49.53,33.02 47.62,33.02 46.35,34.29 44.45,34.29 v43.81,34.93
  Bottom 0.254: v43.81,34.93 ZED1.H20
N$51  (via drill 0.35)
  TopSignal 0.254: U$1.D14 49.53,33.02 47.62,33.02 46.35,34.29 44.45,34.29 v43.81,33.66
  Bottom 0.254: v43.81,33.66 ZED1.H19
N$52  (via drill 0.35)
  BottomSignal 0.254: U$1.F16 27.94,36.83 39.37,36.83 v40,37.47
  Bottom 0.254: v40,37.47 ZED1.G22
N$53  (via drill 0.35)
  TopSignal 0.254: U$1.F17 27.94,36.83 39.37,36.83 v40,36.2
  Bottom 0.254: v40,36.2 ZED1.G21
N$54  (via drill 0.35)
  BottomSignal 0.254: v43.81,42.55 44.45,41.91 45.08,41.91 47.62,39.37 53.09,39.37 53.34,39.12 53.34,38.1 U$1.A17
  Bottom 0.254: v43.81,42.55 ZED1.H26
N$55  (via drill 0.35)
  TopSignal 0.254: U$1.A18 53.34,39.37 47.62,39.37 45.08,41.91 44.45,41.91 v43.81,41.28
  Bottom 0.254: v43.81,41.28 ZED1.H25
N$56  (via drill 0.35)
  BottomSignal 0.254: U$1.C17 50.8,38.1 46.35,38.1 45.08,39.37 39.37,39.37 v38.73,40.01
  Bottom 0.254: v38.73,40.01 ZED1.D24
N$57  (via drill 0.35)
  TopSignal 0.254: U$1.C18 50.8,38.1 46.35,38.1 45.08,39.37 39.37,39.37 v38.73,38.73
  Bottom 0.254: v38.73,38.73 ZED1.D23
N$58  (via drill 0.35)
  BottomSignal 0.254: v43.81,46.36 44.45,45.72 45.08,45.72 48.89,41.91 53.09,41.91 53.34,41.66 53.34,40.64 U$1.A19
  Bottom 0.254: v43.81,46.36 ZED1.H29
N$59  (via drill 0.35)
  TopSignal 0.254: U$1.A20 53.34,41.91 48.89,41.91 45.08,45.72 44.45,45.72 v43.81,45.09
  Bottom 0.254: v43.81,45.09 ZED1.H28
N$60  (via drill 0.35)
  BottomSignal 0.254: U$1.C19 50.8,40.64 48.89,40.64 46.35,43.18 39.37,43.18 v38.73,43.82
  Bottom 0.254: v38.73,43.82 ZED1.D27
N$61  (via drill 0.35)
  TopSignal 0.254: U$1.C20 50.8,40.64 48.89,40.64 46.35,43.18 39.37,43.18 v38.73,42.55
  Bottom 0.254: v38.73,42.55 ZED1.D26
N$62  (via drill 0.35)
  BottomSignal 0.254: U$1.D21 49.53,43.18 48.89,43.18 45.72,46.36 45.72,48.9 45.08,49.53 44.45,49.53 v43.81,50.17
  Bottom 0.254: v43.81,50.17 ZED1.H32
N$63  (via drill 0.35)
  TopSignal 0.254: U$1.D22 49.53,43.18 48.89,43.18 45.72,46.36 45.72,48.9 45.08,49.53 44.45,49.53 v43.81,48.9
  Bottom 0.254: v43.81,48.9 ZED1.H31
N$64  (via drill 0.35)
  BottomSignal 0.254: U$1.A23 53.34,45.72 48.89,45.72 46.61,48.01 46.61,51.82 45.08,53.34 44.45,53.34 v43.81,53.98
  Bottom 0.254: v43.81,53.98 ZED1.H35
N$65  (via drill 0.35)
  TopSignal 0.254: U$1.A24 53.34,45.72 48.89,45.72 46.61,48.01 46.61,51.82 45.08,53.34 44.45,53.34 v43.81,52.7
  Bottom 0.254: v43.81,52.7 ZED1.H34
N$66  (via drill 0.35)
  BottomSignal 0.254: U$1.B24 52.07,46.99 48.89,46.99 47.5,48.39 47.5,54.74 45.08,57.15 44.45,57.15 v43.81,57.79
  Bottom 0.254: v43.81,57.79 ZED1.H38
N$67  (via drill 0.35)
  TopSignal 0.254: U$1.B25 52.07,46.99 48.89,46.99 47.5,48.39 47.5,54.74 45.08,57.15 44.45,57.15 v43.81,56.52
  Bottom 0.254: v43.81,56.52 ZED1.H37
N$68  (via drill 0.35)
  BottomSignal 0.254: U$1.D15 49.53,35.56 47.62,35.56 45.08,38.1 44.45,38.1 v43.81,38.73
  Bottom 0.254: v43.81,38.73 ZED1.H23
N$69  (via drill 0.35)
  TopSignal 0.254: U$1.D16 49.53,35.56 47.62,35.56 45.08,38.1 44.45,38.1 v43.81,37.47
  Bottom 0.254: v43.81,37.47 ZED1.H22
N$70  (via drill 0.35)
  BottomSignal 0.254: U$1.G22 26.67,44.45 29.84,44.45 32.64,47.24 32.64,50.55 34.16,52.07 39.37,52.07 v40,52.7
  Bottom 0.254: v40,52.7 ZED1.G34
N$71  (via drill 0.35)
  TopSignal 0.254: U$1.G23 26.67,44.45 29.84,44.45 32.64,47.24 32.64,50.55 34.16,52.07 39.37,52.07 v40,51.44
  Bottom 0.254: v40,51.44 ZED1.G33
N$72  (via drill 0.35)
  TopSignal 0.254: U$1.E22 29.21,43.18 29.84,43.18 34.92,48.26 39.37,48.26 v40,47.62
  Bottom 0.254: v40,47.62 ZED1.G30
N$73  (via drill 0.35)
  BottomSignal 0.254: U$1.E21 29.21,43.18 29.84,43.18 34.92,48.26 39.37,48.26 v40,48.9
  Bottom 0.254: v40,48.9 ZED1.G31
N$74  (via drill 0.35)
  TopSignal 0.254: U$1.F21 27.94,41.91 29.84,41.91 32.38,44.45 39.37,44.45 v40,43.82
  Bottom 0.254: v40,43.82 ZED1.G27
N$75  (via drill 0.35)
  BottomSignal 0.254: U$1.F20 27.94,41.91 29.84,41.91 32.38,44.45 39.37,44.45 v40,45.09
  Bottom 0.254: v40,45.09 ZED1.G28
N$76  (via drill 0.35)
  TopSignal 0.254: U$1.E20 29.21,40.64 29.84,40.64 32.38,43.18 34.29,43.18 v34.92,42.55
  Bottom 0.254: v34.92,42.55 ZED1.C26
N$77  (via drill 0.35)
  BottomSignal 0.254: U$1.E19 29.21,40.64 29.84,40.64 32.38,43.18 34.29,43.18 v34.92,43.82
  Bottom 0.254: v34.92,43.82 ZED1.C27
N$78  (via drill 0.35)
  TopSignal 0.254: U$1.F19 27.94,39.37 31.11,39.37 32.38,40.64 39.37,40.64 v40,40.01
  Bottom 0.254: v40,40.01 ZED1.G24
N$79  (via drill 0.35)
  BottomSignal 0.254: U$1.F18 27.94,39.37 31.11,39.37 32.38,40.64 39.37,40.64 v40,41.28
  Bottom 0.254: v40,41.28 ZED1.G25
N$80  (via drill 0.35)
  TopSignal 0.254: U$1.E18 29.21,38.1 34.29,38.1 v34.92,37.47
  Bottom 0.254: v34.92,37.47 ZED1.C22
N$81  (via drill 0.35)
  BottomSignal 0.254: U$1.E17 29.21,38.1 34.29,38.1 v34.92,38.73
  Bottom 0.254: v34.92,38.73 ZED1.C23
N$82  (via drill 0.35)
  BottomSignal 0.254: U$1.H23 25.4,45.72 29.84,45.72 31.75,47.62 31.75,52.7 34.92,55.88 39.37,55.88 v40,56.52
  Bottom 0.254: v40,56.52 ZED1.G37
N$83  (via drill 0.35)
  TopSignal 0.254: U$1.H24 25.4,45.72 29.84,45.72 31.75,47.62 31.75,52.7 34.92,55.88 39.37,55.88 v40,55.25
  Bottom 0.254: v40,55.25 ZED1.G36
N$84  (via drill 0.35)
  TopSignal 0.254: U$1.G15 26.67,34.29 38.1,34.29 v40,32.39
  Bottom 0.254: v40,32.39 ZED1.G18
N$85  (via drill 0.35)
  BottomSignal 0.254: U$1.G14 26.67,34.29 38.1,34.29 39.37,33.02 v40,33.66
  Bottom 0.254: v40,33.66 ZED1.G19
N$86  (via drill 0.35)
  TopSignal 0.254: U$1.H14 25.4,33.02 34.29,33.02 v34.92,32.39
  Bottom 0.254: v34.92,32.39 ZED1.C18
N$87  (via drill 0.35)
  BottomSignal 0.254: U$1.H13 25.4,33.02 34.29,33.02 v34.92,33.66
  Bottom 0.254: v34.92,33.66 ZED1.C19
N$88  (via drill 0.35)
  TopSignal 0.254: U$1.G13 26.67,31.75 32.38,31.75 34.92,29.21 39.37,29.21 v40,28.58
  Bottom 0.254: v40,28.58 ZED1.G15
N$89  (via drill 0.35)
  BottomSignal 0.254: U$1.G12 26.67,31.75 32.38,31.75 34.92,29.21 39.37,29.21 v40,29.85
  Bottom 0.254: ZED1.G16 v40,29.85
N$90  (via drill 0.35)
  TopSignal 0.254: U$1.H12 25.4,30.48 31.11,30.48 33.66,27.94 34.29,27.94 v34.92,27.3
  Bottom 0.254: v34.92,27.3 ZED1.C14
N$91  (via drill 0.35)
  BottomSignal 0.254: U$1.H11 25.4,30.48 31.11,30.48 33.66,27.94 34.29,27.94 v34.92,28.58
  Bottom 0.254: v34.92,28.58 ZED1.C15
N$92  (via drill 0.35)
  TopSignal 0.254: U$1.G11 26.67,29.21 29.84,29.21 33.66,25.4 39.37,25.4 v40,24.77
  Bottom 0.254: v40,24.77 ZED1.G12
N$93  (via drill 0.35)
  TopSignal 0.254: U$1.B9 52.07,26.67 44.45,26.67 v43.81,26.04
  Bottom 0.254: v43.81,26.04 ZED1.H13
N$94  (via drill 0.35)
  TopSignal 0.254: U$1.F9 27.94,26.67 29.84,26.67 33.66,22.86 34.29,22.86 v34.92,22.23
  Bottom 0.254: v34.92,22.23 ZED1.C10
N$95  (via drill 0.35)
  BottomSignal 0.254: U$1.F8 27.94,26.67 29.84,26.67 33.66,22.86 34.29,22.86 v34.92,23.5
  Bottom 0.254: ZED1.C11 v34.92,23.5
N$96  (via drill 0.35)
  TopSignal 0.254: U$1.E8 29.21,25.4 29.84,25.4 33.66,21.59 39.37,21.59 v40,20.96
  Bottom 0.254: v40,20.96 ZED1.G9
N$97  (via drill 0.35)
  BottomSignal 0.254: U$1.E7 29.21,25.4 29.84,25.4 33.66,21.59 39.37,21.59 v40,22.23
  Bottom 0.254: v40,22.23 ZED1.G10
N$98  (via drill 0.35)
  TopSignal 0.254: U$1.F7 27.94,24.13 29.84,24.13 33.66,20.32 33.66,19.05 34.92,17.78 39.37,17.78 v40,17.15
  Bottom 0.254: v40,17.15 ZED1.G6
N$99  (via drill 0.35)
  BottomSignal 0.254: U$1.F6 27.94,24.13 29.84,24.13 33.66,20.32 33.66,19.05 34.92,17.78 39.37,17.78 v40,18.42
  Bottom 0.254: ZED1.G7 v40,18.42
N$100  (via drill 0.35)
  BottomSignal 0.254: U$1.E5 29.21,22.86 29.84,22.86 32.77,19.94 32.77,17.4 34.92,15.24 39.37,15.24 v40,15.88
  Bottom 0.254: ZED1.H5 41.91,16.51 40.64,16.51 v40,15.88
N$101  (via drill 0.35)
  TopSignal 0.254: U$1.E6 29.21,22.86 29.84,22.86 32.77,19.94 32.77,17.4 34.92,15.24 39.37,15.24 v40,14.61
  Bottom 0.254: v40,14.61 40.64,13.97 41.91,13.97 ZED1.H4
N$102  (via drill 0.35)
  BottomSignal 0.254: U$1.G6 26.67,22.86 26.67,21.84 26.92,21.59 29.84,21.59 31.88,19.56 31.88,15.75 34.92,12.7 39.37,12.7 v40,13.34
  Bottom 0.254: ZED1.G3 v40,13.34
N$103  (via drill 0.35)
  TopSignal 0.254: U$1.G7 26.67,24.13 26.67,21.84 26.92,21.59 29.84,21.59 31.88,19.56 31.88,15.75 34.92,12.7 39.37,12.7 v40,12.07
  Bottom 0.254: v40,12.07 ZED1.G2
N$104  (via drill 0.35)
  BottomSignal 0.254: U$1.A5 53.34,22.86 47.62,22.86 45.08,20.32 39.37,20.32 v38.73,20.96
  Bottom 0.254: v38.73,20.96 ZED1.D9
N$105  (via drill 0.35)
  TopSignal 0.254: U$1.A6 53.34,22.86 47.62,22.86 45.08,20.32 39.37,20.32 v38.73,19.69
  Bottom 0.254: v38.73,19.69 ZED1.D8
N$106
  TopSignal 0.305: U$1.H30 8.45,53.98 8.24,54.19 6,54.19 PMOD.9
N$107
  BottomSignal 0.305: U$1.E29 27.94,53.34 8.39,53.34 8.24,53.19 PMOD.3
N$108
  Top 0.305: RN2.5 9.58,13.02 8.49,14.12 U1.4 4.43,14.12 TP1.TP
N$110  (via drill 0.35)
  Top 0.305: v4.45,29.72 4.71,29.48 4.71,26.56 4.56,26.41 U2.2 4.56,24.14 4.94,23.76 R6.2
  BottomSignal 0.305: U$1.F30 26.03,55.25 10.16,55.25 8,57.4 3.05,57.4 2.16,56.52 2.16,32 v4.45,29.72
N$111
  Top 0.305: U2.1 5.06,26.15 5.7,26.78 R5.1
N$112
  Top 0.305: RN2.6 8.78,12.55 7.87,13.47 U1.5 3.3,13.47 TP2.TP
N$113
  Top 0.305: TP8.TP 4.19,28.07 4.19,26.8 4.06,26.67 U2.3
N$114
  Top 0.305: 3.46,27.02 TP7.TP 3.56,26.92 U2.4
N$115
  Top 0.305: RN1.5 13.2,11.57 | RN1.6 RN1.5 | 13.26,11.52 arc-90 RN1.5 | U1.17 13.26,11.52 | 13.26,11.52 RN1.5
N$116
  Top 0.305: RN2.7 7.98,11.58 7.39,12.17 U1.7 3.27,12.17 TP3.TP
N$117
  Top 0.305: 3.07,9.63 TP4.TP 3.13,9.57 U1.11
N$118
  Top 0.305: TP5.TP 11.24,6.92 U1.13
N$119
  Top 0.305: RN1.8 RN1.7 12.98,9.88 11.99,10.87 U1.16
N$120
  Bottom 0.305: U3.1 58.56,12.18 58.93,12.57 R2.2
N$121
  Top 0.305: R5.2 7.1,27.53 LED.A
N$123  (via drill 0.35)
  Top 0.305: TP6.TP 59.69,3.3 v58.67,4.06
  Bottom 0.305: U3.10 58.56,4.18 v58.67,4.06
SCL  (via drill 0.35)
  Top 0.305: U4.2 41.66,49.53 41.02,50.17 v34.29,50.17 33.66,50.17 33.02,50.8 v33.02,57.15 | U5.2 37.08,22.35 36.58,21.84 35.56,21.84 34.54,20.83 34.54,11.94 v33.78,11.18 | U1.3 6.95,14.83 v7.87,15.75 | v3.56,19.3 4.06,19.81 U2.8
  TopSignal 0.305: v55.37,9.91 53.85,11.43 49.53,11.43 49.28,11.18 v33.78,11.18 v31.11,11.18
  BottomSignal 0.305: v33.02,57.15 31.88,58.29 2.54,58.29 1.4,57.15 1.4,17.91 | 1.4,17.91 1.4,6.48 2.67,5.21 17.53,5.21 19.3,6.99 19.3,11.56 v19.94,12.19 | v7.87,15.75 7.87,17.02 6.98,17.91 2.16,17.91 | 2.16,17.91 1.4,17.91 | v3.56,19.3 2.16,17.91
  Bottom 0.305: ZED1.C30 35.56,47.62 34.29,48.9 v34.29,50.17 | v31.11,11.18 30.86,11.43 20.7,11.43 v19.94,12.19 | U3.7 60.06,7.5 59.69,7.87 57.4,7.87 v55.37,9.91
SDA  (via drill 0.35)
  Top 0.305: U4.1 41.15,48.07 41.15,46.99 40.64,46.48 35.56,46.48 34.92,47.12 v34.92,49.53 | U5.1 37.58,22.09 36.83,21.34 35.81,21.34 35.05,20.57 35.05,10.67 v34.92,10.54 | v33.66,57.79 33.66,51.18 34.04,50.8 v34.92,50.8 | U1.2 6.59,15.48 v7.11,16 | v4.06,18.8 4.56,19.3 U2.9
  TopSignal 0.305: v33.66,57.79 33.15,58.29 2.54,58.29 1.4,57.15 1.4,17.91 | 1.4,17.91 1.4,6.48 2.67,5.21 17.53,5.21 19.3,6.99 19.3,10.29 v19.94,10.92 | v55.12,8.89 53.21,10.8 50.04,10.8 49.78,10.54 v34.92,10.54 v30.35,10.54 | v7.11,16 7.11,17.02 6.22,17.91 3.17,17.91 | 3.17,17.91 1.4,17.91 | v4.06,18.8 3.17,17.91
  Bottom 0.305: ZED1.C31 35.56,48.9 v34.92,49.53 v34.92,50.8 | v30.35,10.54 29.97,10.92 v19.94,10.92 | U3.8 59.56,6.99 59.18,7.37 57.15,7.37 55.63,8.89 v55.12,8.89
VTREF
  Bottom 0.305: 53.97,15.24 C51.1 57.66,15.25 R3.1 R2.1
  Bottom 0.406: U$1.B2 53.34,17.78 53.34,15.88 53.97,15.24 C24.1
VTSIG  (via drill 0.35)
  Top 0.305: v60.45,14.73 60.45,15.75 59.44,16.76 v55.63,16.76 54.61,17.78 52.07,17.78 U$1.C2
  Bottom 0.305: v55.63,16.76 C52.1 | v60.45,14.73 60.83,14.35 60.83,13.86 R4.1 R1.1
  Bottom 0.406: U$1.C2 50.8,17.78 50.8,15.88 50.16,15.24 C25.1

## Text on the board
_tsilk: CMV12000 ADAPTER | Copyright (C) 2013 H.Poetzl / Licensed under CERN OHL v.1.1
_bsilk: 3V0 | 1V8